# EAGLE design uc3906 charger 2 (EAGLE 9.6.2)
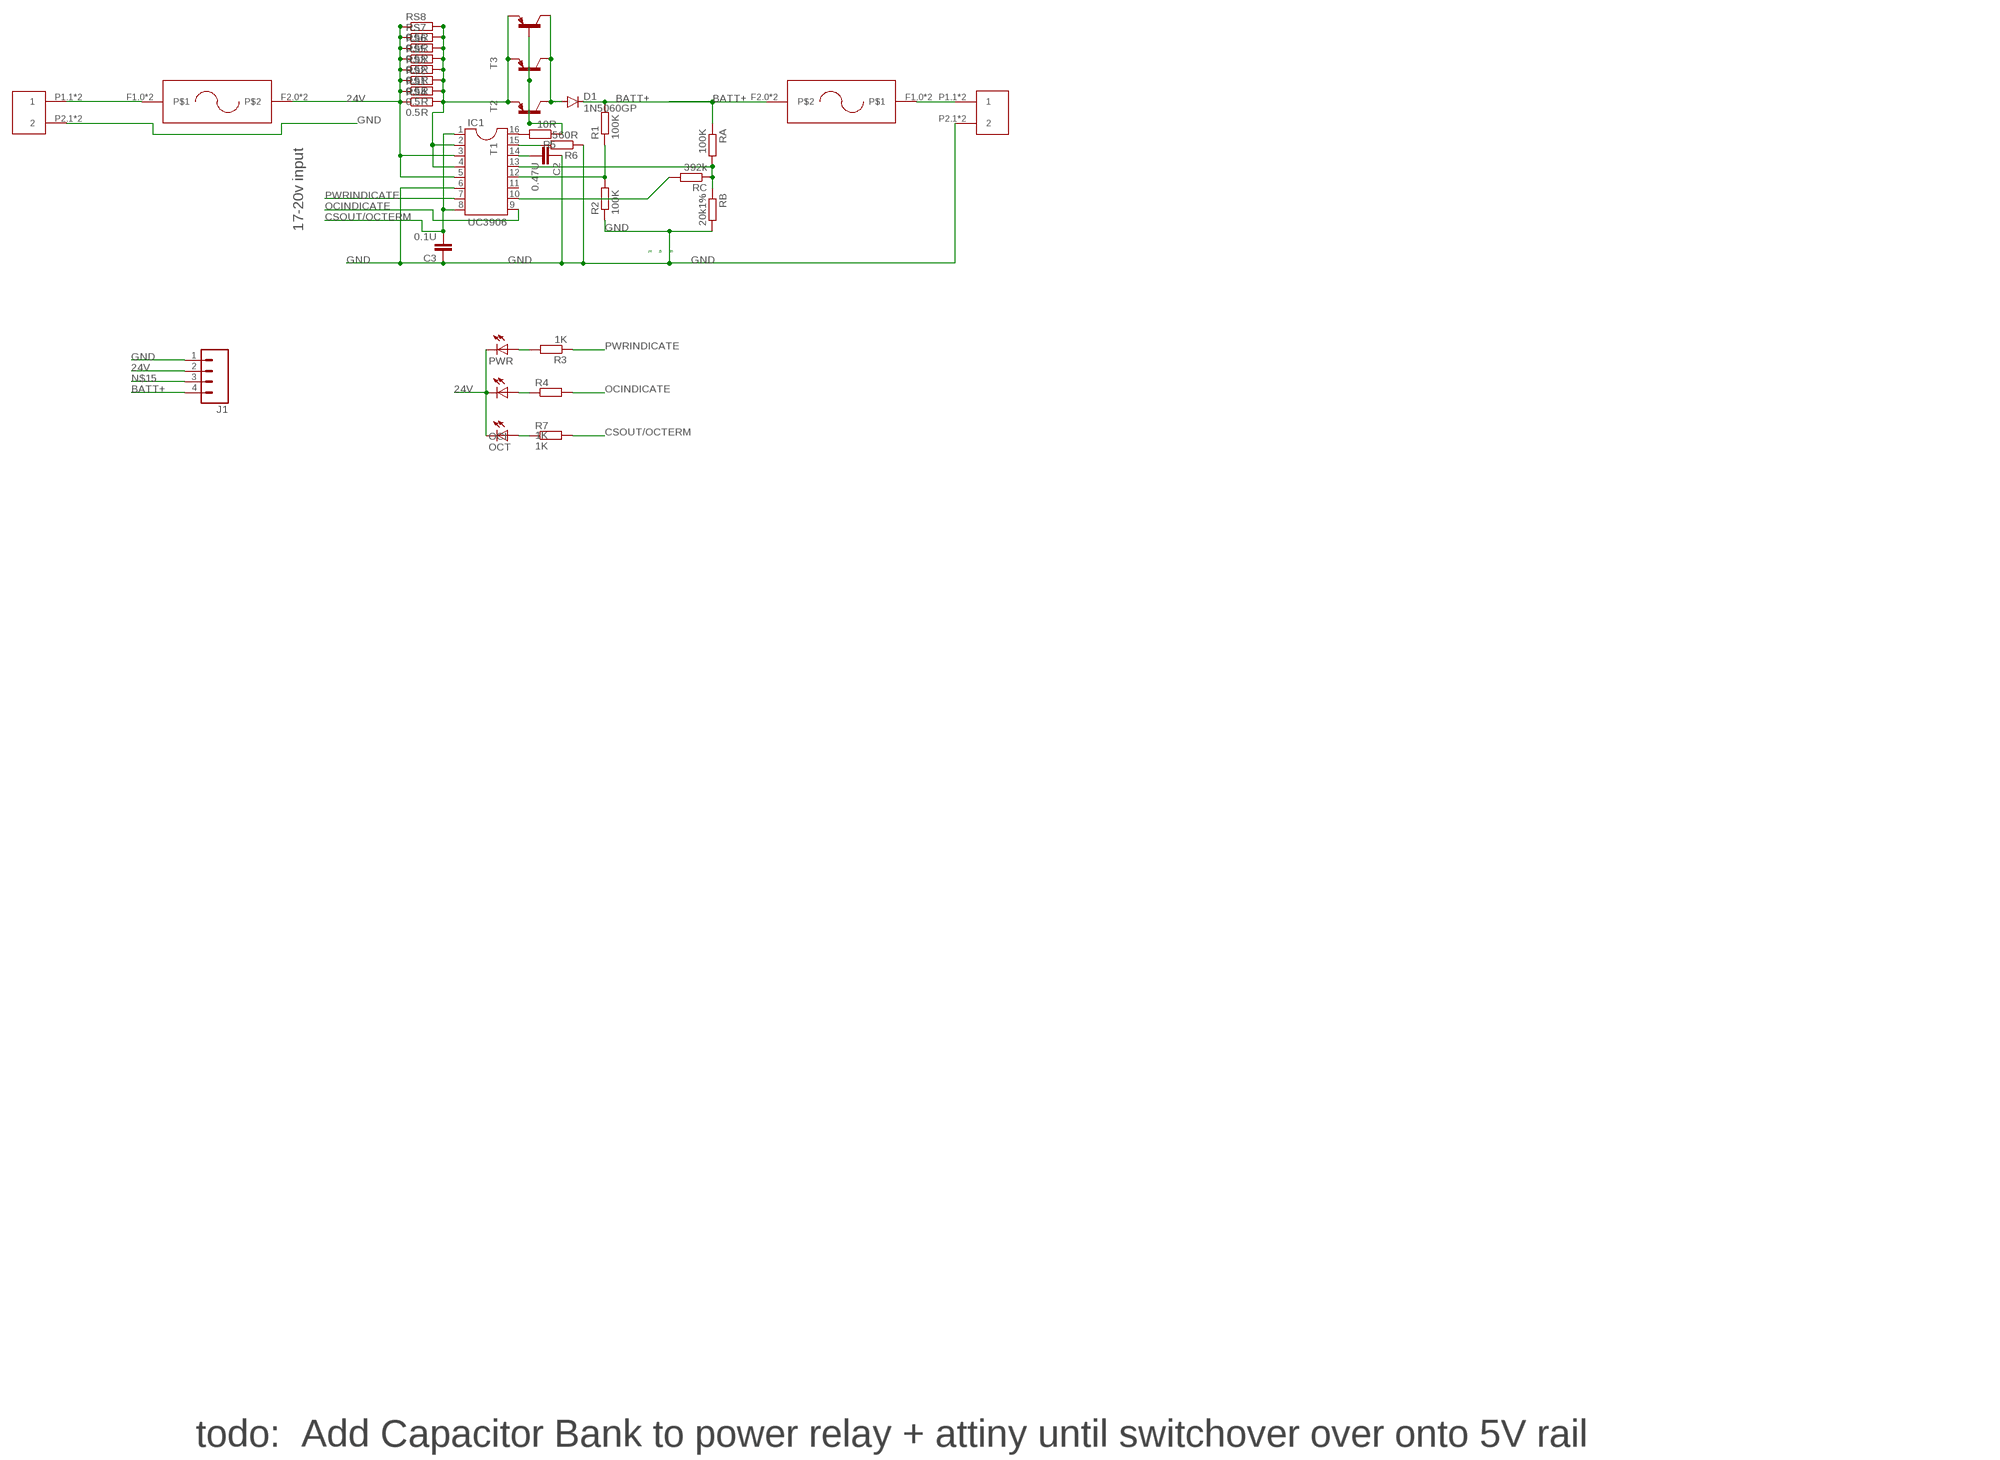
[diagram p0: schematic, sheet 1]

## Parts
BATT  BARRIERTERMINAL  [BARRIERTERMINAL]
C2  0.47U  C-EU050-024X044  [C050-024X044]
C3  0.1U  C-EU050-024X044  [C050-024X044]
D1  1N5060GP  [DO15-12]
IC1  UC3906  DIL16  [DIL16]
J1  CONN_04LONGPADS  [1X04_LONGPADS]
OCI  LED5MM  [LED5MM]
OCT  LED5MM  [LED5MM]
POWERIN  BARRIERTERMINAL  [BARRIERTERMINAL]
PWR  LED5MM  [LED5MM]
R1  100K  R-EU_0204/7  [0204/7]
R2  100K  R-EU_0204/7  [0204/7]
R3  1K  R-EU_0204/7  [0204/7]
R4  1K  R-EU_0204/7  [0204/7]
R5  10R  R-EU_0204/7  [0204/7]
R6  560R  R-EU_0204/7  [0204/7]
R7  1K  R-EU_0204/7  [0204/7]
RA  100K  R-EU_0204/7  [0204/7]
RB  20k1%  R-EU_0204/7  [0204/7]
RC  392k  R-EU_0204/7  [0204/7]
RS1  0.5R  R-EU_0411/15  [0411/15]
RS2  0.5R  R-EU_0411/15  [0411/15]
RS3  0.5R  R-EU_0411/15  [0411/15]
RS4  0.5R  R-EU_0411/15  [0411/15]
RS5  0.5R  R-EU_0411/15  [0411/15]
RS6  0.5R  R-EU_0411/15  [0411/15]
RS7  0.5R  R-EU_0411/15  [0411/15]
RS8  0.5R  R-EU_0411/15  [0411/15]
T1  TIP32C  [TO220]
T2  TIP32C  [TO220]
T3  TIP32C  [TO220]
U$1  18MMFUSEHOLDER  [18MMFUSEHOLDER]
U$2  18MMFUSEHOLDER  [18MMFUSEHOLDER]

## Nets
24V: IC1.3 IC1.5 J1.2 OCI.K(C) OCT.K(C) PWR.K(C) RS1.1 RS2.1 RS3.1 RS4.1 RS5.1 RS6.1 RS7.1 RS8.1 U$2.F2.0 U$2.F2.1
BATT+: D1.C J1.4 R1.2 RA.1 U$1.F2.0 U$1.F2.1
CHARGEENABLE: IC1.12 R1.1 R2.2
COMPENSATION: C2.2 IC1.14
CSOUT/OCTERM: C3.2 IC1.1 IC1.8 R7.2
DRIVERSINK: IC1.16 R5.2
DRIVERSOURCE: IC1.15 R6.2
GND: BATT.P2.1 BATT.P2.2 C2.1 C3.1 IC1.6 J1.1 POWERIN.P2.1 POWERIN.P2.2 R2.1 R6.1 RB.2
IOUT: IC1.2 IC1.4 RS1.2 RS2.2 RS3.2 RS4.2 RS5.2 RS6.2 RS7.2 RS8.2 T1.3(E) T2.3(E) T3.3(E)
N$1: POWERIN.P1.1 POWERIN.P1.2 U$2.F1.0 U$2.F1.1
N$2: PWR.A R3.2
N$5: OCI.A R4.1
N$6: OCT.A R7.1
N$9: BATT.P1.1 BATT.P1.2 U$1.F1.0 U$1.F1.1
N$14: R5.1 T1.1(B) T2.1(B) T3.1(B)
N$15: D1.A J1.3 T1.2(C) T2.2(C) T3.2(C)
OCINDICATE: IC1.9 R4.2
PWRINDICATE: IC1.7 R3.1
STATELEVELCONTROL: IC1.10 RC.2
VSENSE: IC1.13 RA.2 RB.1 RC.1
Unconnected: IC1.11

## Notes on the sheet
- 17-20v input
- J4 | J5 | J6
- todo:  Add Capacitor Bank to power relay + attiny until switchover over onto 5V rail

## Library data of the parts
BATT POWERIN = Barrier Terminals 2 pin:BARRIERTERMINAL
C2 C3 = rcl:C-EU: CAPACITOR, European symbol
D1 = diode:1N5060GP: DIODE controlled avalanche rectifier
IC1 = ic-package:DIL16: Dual In Line / Socket
J1 = SparkFun-Connectors2:CONN_04: Multi connection point. Often used as Generic Header-pin footprint for 0.1 inch spaced/style header connections On any of the 0.1 inch spaced packages, you can populate with these: Break Away Headers - Straight <https://www.sparkfun.com/products/116> (PRT-00116) Break Away Male Headers - Right Angle <https://www.sparkfun.com/products/553> (PRT-00553) Female Headers <https://www.sparkfun.com/products/115> (PRT-00115) Break Away Headers - Machine Pin <https://www.sparkfun.com/products/117> (PRT-00117) Break Away Female Headers - Swiss Machine Pin <https://www.sparkfun.com/products/743> (PRT-00743) For SCREWTERMINALS and SPRING TERMINALS visit here: Screw Terimnals on SparkFun.com <https://www.sparkfun.com/search/results?term=Screw+Terminals> (5mm/3.5mm/2.54mm spacing) This device is also useful as a general connection point to wire up your design to another part of your project. Our various solder wires solder well into these plated through hole pads. Hook-Up Wire - Assortment (Stranded, 22 AWG) <https://www.sparkfun.com/products/11375> (PRT-11375) Hook-Up Wire - Assortment (Solid Core, 22 AWG) <https://www.sparkfun.com/products/11367> (PRT-11367) View the entire wire category on our website here <https://www.sparkfun.com/categories/141> Special notes: Molex polarized connector foot print use with SKU : PRT-08231 with associated crimp pins and housings. 1MM SMD Version SKU: PRT-10208; PROD_ID: CONN-09696
OCI OCT PWR = RepRapjr:LED: LED OSRAM: - CHIPLED LG R971, LG N971, LY N971, LG Q971, LY Q971, LO R971, LY R971 LH N974, LH R974 LS Q976, LO Q976, LY Q976 LO Q996 - Hyper CHIPLED LW Q18S LB Q993, LB Q99A, LB R99A - SideLED LS A670, LO A670, LY A670, LG A670, LP A670 LB A673, LV A673, LT A673, LW A673 LH A674 LY A675 LS A676, LA A676, LO A676, LY A676, LW A676 LS A679, LY A679, LG A679 - Hyper Micro SIDELED® LS Y876, LA Y876, LO Y876, LY Y876 LT Y87S - SmartLED LW L88C, LW L88S LB L89C, LB L89S, LG L890 LS L89K, LO L89K, LY L89K LS L896, LA L896, LO L896, LY L896 - TOPLED LS T670, LO T670, LY T670, LG T670, LP T670 LSG T670, LSP T670, LSY T670, LOP T670, LYG T670 LG T671, LOG T671, LSG T671 LB T673, LV T673, LT T673, LW T673 LH T674 LS T676, LA T676, LO T676, LY T676, LB T676, LH T676, LSB T676, LW T676 LB T67C, LV T67C, LT T67C, LS T67K, LO T67K, LY T67K, LW E67C LS E67B, LA E67B, LO E67B, LY E67B, LB E67C, LV E67C, LT E67C LW T67C LS T679, LY T679, LG T679 LS T770, LO T770, LY T770, LG T770, LP T770 LB T773, LV T773, LT T773, LW T773 LH T774 LS E675, LA E675, LY E675, LS T675 LS T776, LA T776, LO T776, LY T776, LB T776 LHGB T686 LT T68C, LB T68C - Hyper Mini TOPLED® LB M676 - Mini TOPLED Santana® LG M470 LS M47K, LO M47K, LY M47K Source: http://www.osram.convergy.de LUXEON: - LUMILED® LXK2-PW12-R00, LXK2-PW12-S00, LXK2-PW14-U00, LXK2-PW14-V00 LXK2-PM12-R00, LXK2-PM12-S00, LXK2-PM14-U00 LXK2-PE12-Q00, LXK2-PE12-R00, LXK2-PE12-S00, LXK2-PE14-T00, LXK2-PE14-U00 LXK2-PB12-K00, LXK2-PB12-L00, LXK2-PB12-M00, LXK2-PB14-N00, LXK2-PB14-P00, LXK2-PB14-Q00 LXK2-PR12-L00, LXK2-PR12-M00, LXK2-PR14-Q00, LXK2-PR14-R00 LXK2-PD12-Q00, LXK2-PD12-R00, LXK2-PD12-S00 LXK2-PH12-R00, LXK2-PH12-S00 LXK2-PL12-P00, LXK2-PL12-Q00, LXK2-PL12-R00 Source: www.luxeon.com KINGBRIGHT: KA-3528ASYC Source: www.kingbright.com
R1-R7 RA RB RC = rcl:R-EU_: RESISTOR, European symbol
RS1-RS8 = resistor:R-EU_: RESISTOR, European symbol
T1-T3 = transistor:TIP32: PNP Transistor Medium Power Linear Switching Applications Source: http://onsemi.com
U$1 U$2 = Fuse Holder:18MMFUSEHOLDER

## Net classes
0 default: width 0.203 mm, clearance 0.152 mm
1 power: width 0.6 mm, clearance 0.305 mm

## Board
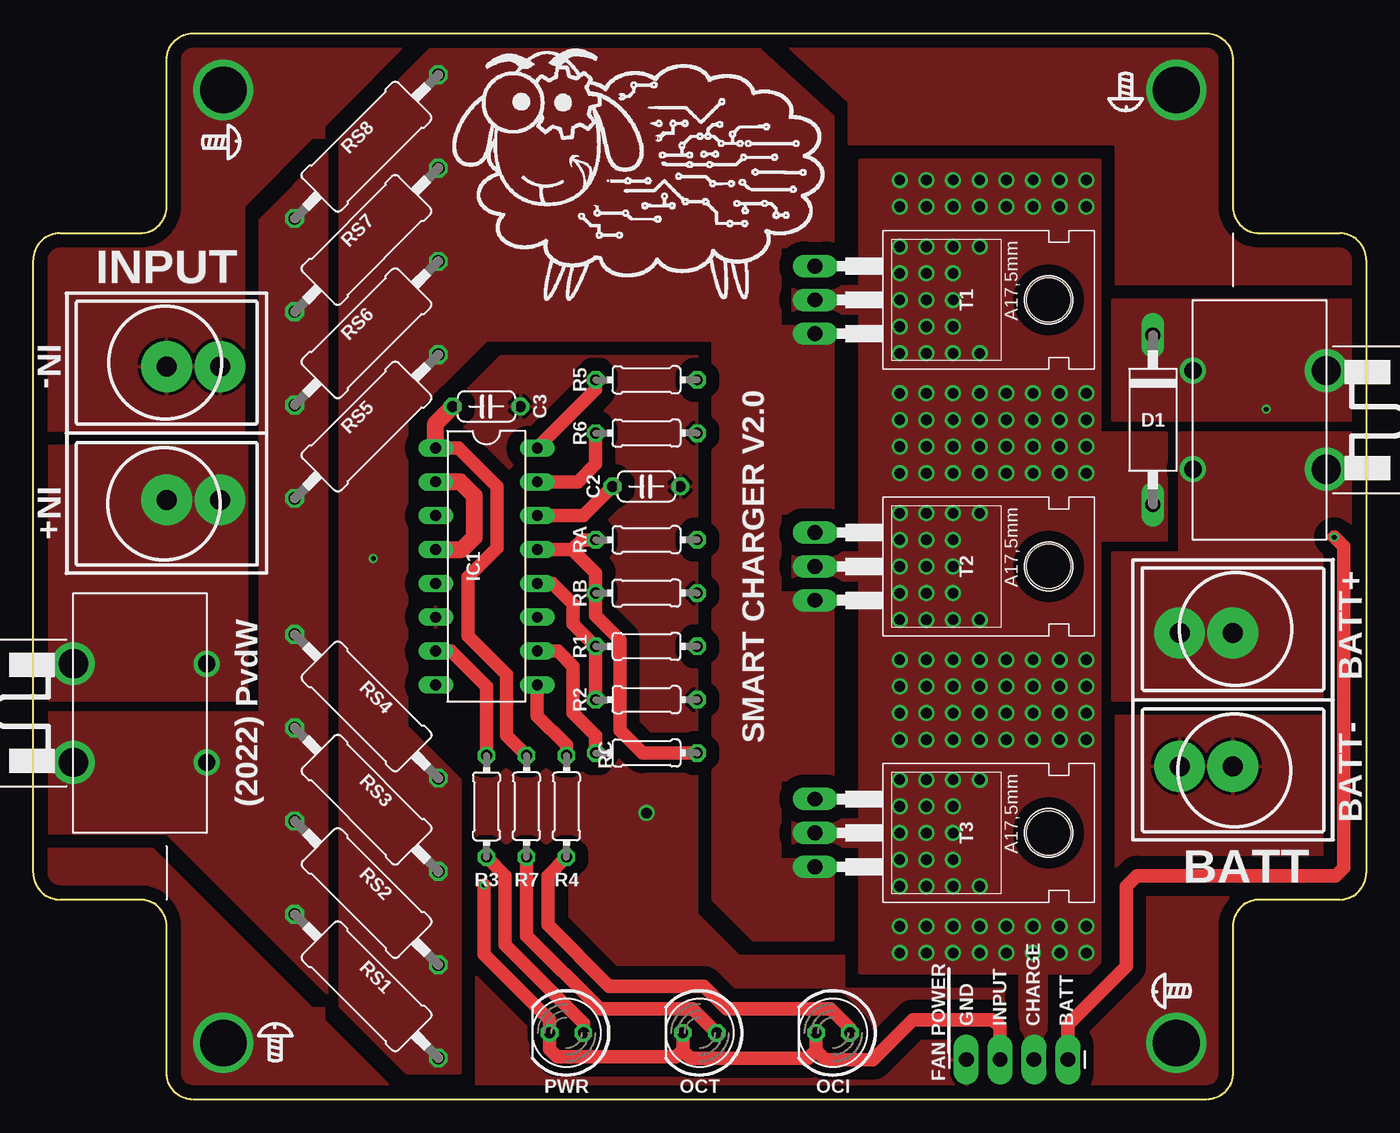
[diagram p1: board, top side]
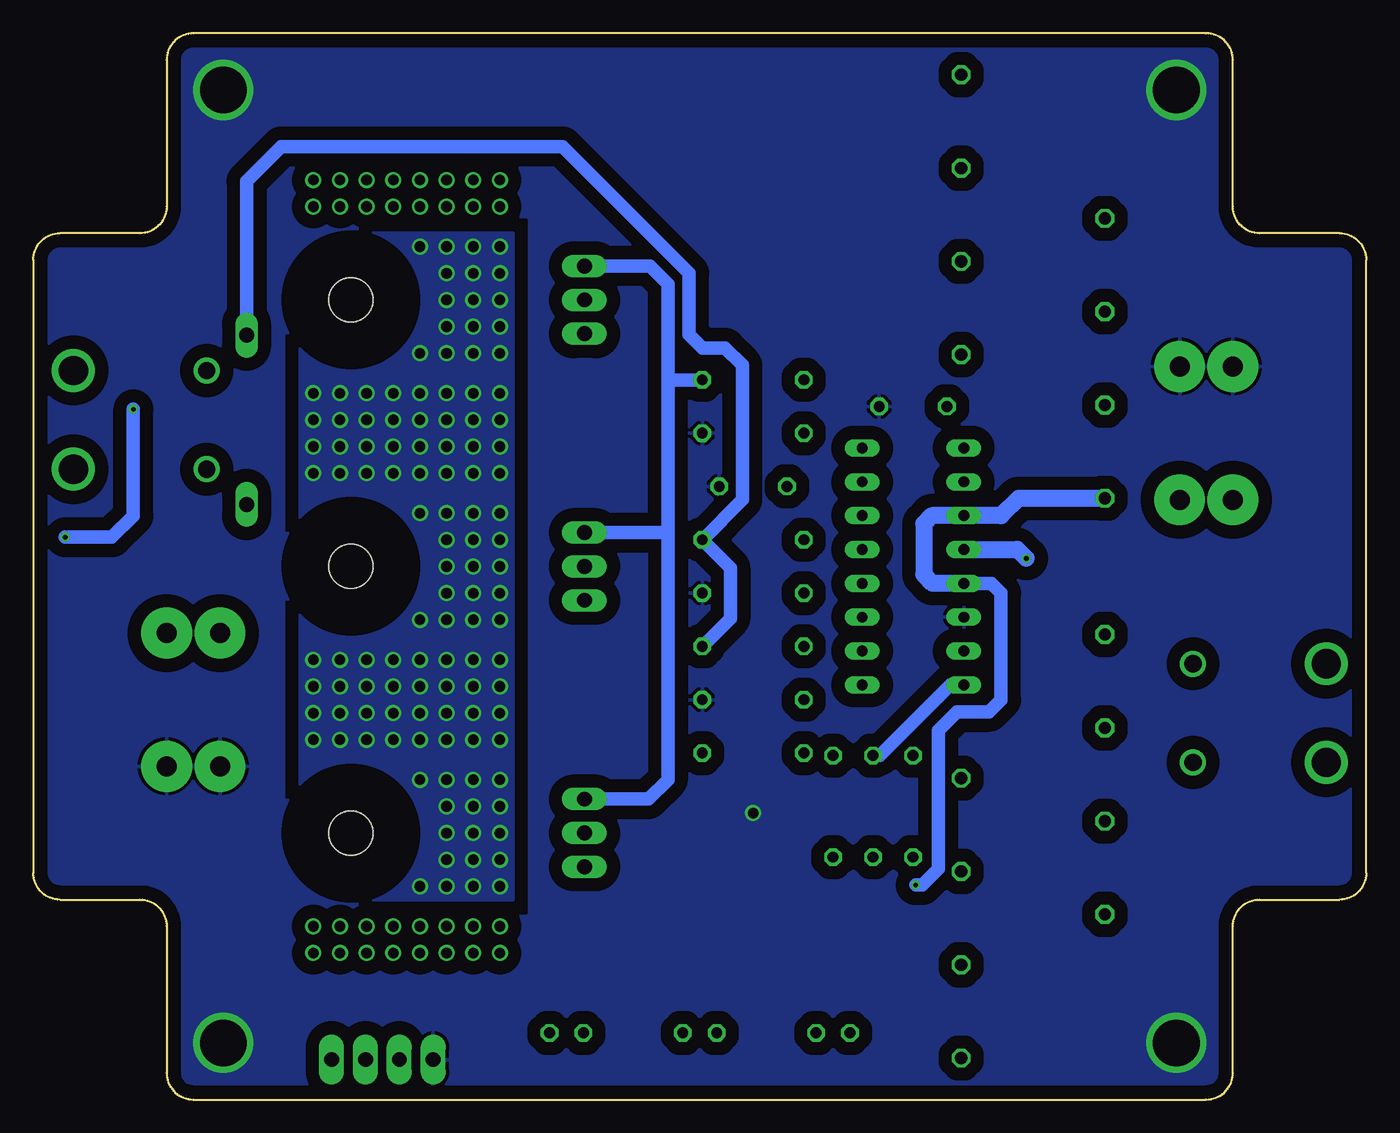
[diagram p2: board, bottom side, seen from below]

Size 100 x 80 mm. Coordinates in mm from the lower left corner, seen from the top.
Outline: 10,2 10,13 arc90 8,15 2,15 arc-90 0,17 0,63 arc-90 2,65 8,65 arc90 10,67 10,78 arc-90 12,80 88,80 arc-90 90,78 90,67 arc90 92,65 98,65 arc-90 100,63 100,17 arc-90 98,15 92,15 arc90 90,13 90,2 arc-90 88,0 12,0 arc-90 10,2
Copper layers (1*16): Top 0.035mm / dielectric 1.5mm / Bottom 0.035mm
Design rules "dirt_cheap_dirty_boards.v1": minimum track width 5mil, minimum drill 12mil, track to track 5mil, track to pad 5mil, pad to pad 5mil, via to via 5mil, smd to smd 0mil, copper to edge 10mil, drill to drill 10mil, minimum pad ring 10mil, minimum via ring 6mil, stop-mask expansion 2mil, vias tented up to drill 25mil, thermal gap 10mil

### Footprints (pad centres in the part's own frame; a part is rotated, then mirrored left to right if it is on the bottom)
BARRIERTERMINAL = drill 1.5 pad 3.81: P1.1 -5,0; P1.2 -5,-4; P2.1 5,0; P2.2 5,-4
C050-024X044 = drill 0.813 octagon: 1 -2.54,0; 2 2.54,0
DO15-12 = drill 1.118 long: A 6.35,0; C -6.35,0
DIL16 = drill 0.813 long: 1 -8.89,-3.81; 2 -6.35,-3.81; 3 -3.81,-3.81; 4 -1.27,-3.81; 5 1.27,-3.81; 6 3.81,-3.81; 7 6.35,-3.81; 8 8.89,-3.81; 9 8.89,3.81; 10 6.35,3.81; 11 3.81,3.81; 12 1.27,3.81; 13 -1.27,3.81; 14 -3.81,3.81; 15 -6.35,3.81; 16 -8.89,3.81
1X04_LONGPADS = drill 1.118 pad 1.88 long: 1 0,0; 2 2.54,0; 3 5.08,0; 4 7.62,0
LED5MM = drill 0.813 octagon: A -1.27,0; K 1.27,0
0204/7 = drill 0.813 octagon: 1 -3.81,0; 2 3.81,0
0411/15 = drill 0.914 octagon: 1 -7.62,0; 2 7.62,0
TO220 = drill 1.118 long: 1 -2.54,-6.35; 2 0,-6.35; 3 2.54,-6.35 | hole 3.302: 0,11.176
18MMFUSEHOLDER = drill 1.3: F1.0 -3.7,5; F2.0 3.7,5 | drill 2.2: F1.1 -3.7,-5; F2.1 3.7,-5

### Placement (x,y rotation side)
BATT  90,30 270 top
C2  46,46 180 top
C3  34,52 180 top
D1  84,51 270 top
IC1  34,40 270 top
J1  70,3 0 top
OCI  60,5 180 top
OCT  50,5 180 top
POWERIN  10,50 90 top
PWR  40,5 180 top
R1  46,34 0 top
R2  46,30 180 top
R3  34,22 270 top
R4  40,22 90 top
R5  46,54 180 top
R6  46,50 180 top
R7  37,22 90 top
RA  46,42 180 top
RB  46,38 0 top
RC  46,26 180 top
RS1  25,8.5 315 top
RS2  25,15.5 315 top
RS3  25,22.5 315 top
RS4  25,29.5 315 top
RS5  25,50.5 45 top
RS6  25,57.5 45 top
RS7  25,64.5 45 top
RS8  25,71.5 45 top
T1  65,60 270 top
T2  65,40 270 top
T3  65,20 270 top
U$1  92,51 90 top
U$2  8,29 270 top

### Tracks (layer width: path | path; a pad name or v marks a point on that pad's centre or on a via)
24V  (via drill 0.35)
  Top 1.016: OCI.K 58.73,3.7 | 58.73,3.7 58.13,3.1 49.3,3.1 48.73,3.67 OCT.K 48.73,3.73 48.2,3.2 39.3,3.2 38.73,3.77 PWR.K 38.73,5.97 33.8,10.9 v33.8,16.1 | J1.2 72.5,3.04 72.5,5.5 72,6 66,6 63,3 59.43,3 58.73,3.7
  Bottom 1.016: v33.8,16.1 33.3,16.1 32.1,17.3 32.1,27.7 30.7,29.1 28.3,29.1 27.4,30 27.4,38 28.13,38.73 IC1.5
  Bottom 1.27: RS5.1 26.09,45.11 27.39,43.81 IC1.3 32.59,43.81 33.2,43.2 33.2,39.4 32.53,38.73 IC1.5
  pour Top (isolate 1, no thermals): 1,29 17,29 17,66 22,71 22,8 10,20 1,20
BATT+  (via drill 0.35)
  Top 1.016: J1.4 77.62,5.62 82,10 82,16 82.8,16.8 97.7,16.8 98.3,17.4 98.3,41.5 v97.6,42.2
  Bottom 1.016: R1.2 47.7,36.11 47.7,39.89 RA.1 46.8,45.01 46.8,55.1 48.1,56.4 49.8,56.4 50.8,57.4 50.8,62 60.3,71.5 81.4,71.5 84,68.9 D1.C | v97.6,42.2 94.1,42.2 92.5,43.8 v92.5,51.8
  pour Top (isolate 1, no thermals): 81,51 99,51 99,60 81,60
CHARGEENABLE
  Top 1.016: R2.2 R1.1 40.5,35.69 40.5,37.2 38.97,38.73 IC1.12
COMPENSATION
  Top 1.016: IC1.14 41.27,43.81 C2.2
CSOUT/OCTERM
  Top 1.016: R7.2 35.5,27.31 35.5,31.9 32.6,34.8 32.6,39.2 34.8,41.4 34.8,46 31.91,48.89 IC1.1
  Top 1.27: IC1.1 30.19,50.73 C3.2
  Bottom 1.016: IC1.8 31.19,31.11 36.49,25.81 R7.2
DRIVERSINK
  Top 1.016: IC1.16 42.19,53.27 R5.2
DRIVERSOURCE
  Top 1.016: IC1.15 40.85,46.35 42.19,47.69 R6.2
GND  (via drill 0.8, 3.5)
  other vias: 14.25,4.25 85.75,4.25 85.75,75.75 14.25,75.75 46,21.5
  pour Top (isolate 1, rank 6): 0,63 2,65 8,65 10,67 10,78 12,80 88,80 90,78 90,67 92,65 98,65 100,63 100,17 98,15 92,15 90,13 90,2 88,0 12,0 10,2 10,13 8,15 2,15 0,17
  pour Bottom (isolate 1, rank 6): 0,63 2,65 8,65 10,67 10,78 12,80 88,80 90,78 90,67 92,65 98,65 100,63 100,17 98,15 92,15 90,13 90,2 88,0 12,0 10,2 10,13 8,15 2,15 0,17
IOUT  (via drill 0.35)
  Top 1.27: IC1.4 32.17,41.27 33.1,42.2 33.1,45.3 32.05,46.35 IC1.2
  Bottom 1.27: IC1.4 26.17,41.27 v25.5,40.6
  pour Top (isolate 1, no thermals): 60,58 56,58 56,64 60,64 60,73.77 54.25,79 30,79 23,72 23,7 28,2 32,2 32,24 28,28 28,51 34,57 51,57 51,15 54,12 60,12 60,18 56,18 56,24 60,24 60,38 56,38 56,44 60,44
N$1
  pour Top (isolate 1, no thermals): 1,30 16,30 16,49 1,49
N$2
  Top 1.016: R3.2 35.4,16.79 35.4,11.59 41.27,5.72 PWR.A
N$5
  Top 1.016: R4.1 38.6,16.79 38.6,13.1 43.2,8.5 50.3,8.5 52,6.8 59.8,6.8 61.27,5.33 OCI.A
N$6
  Top 1.016: R7.1 37,12.3 42.5,6.8 49.47,6.8 OCT.A
N$9
  pour Top (isolate 1, no thermals): 82,41 86,41 86,50 99,50 99,30 81,30 81,41
N$14
  Bottom 1.016: T3.1 53.86,22.54 52.4,24 52.4,42.6 | T2.1 52.46,42.54 52.4,42.6 | T1.1 53.74,62.54 52.4,61.2 52.4,54 | 52.4,42.6 52.4,54 | R5.1 52.4,54
N$15  (via drill 0.8)
  other vias: 65,64 67,64 69,64 71,64 65,62 67,62 69,62 69,60 67,60 65,60 65,58 67,58 69,58 71,56 69,56 67,56 65,56 65,44 67,44 69,44 71,44 71,36 69,36 67,36 65,36 65,38 65,40 65,42 67,42 67,40 67,38 69,38 69,40 69,42 65,24 67,24 69,24 71,24 71,16 69,16 67,16 65,16 65,18 65,20 65,22 67,22 67,20 67,18 69,18 69,20 69,22 67,27 67,29 67,31 67,33 69,33 69,31 69,29 69,27 71,27 71,29 71,31 71,33 65,33 65,31 65,29 65,27 73,27 73,29 73,31 73,33 75,33 75,31 75,29 75,27 77,27 77,29 77,31 77,33 79,33 79,31 79,29 79,27 65,47 65,49 65,51 65,53 67,53 67,51 67,49 67,47 69,47 69,49 69,51 69,53 71,53 71,51 71,49 71,47 73,47 73,49 73,51 73,53 75,53 75,51 75,49 75,47 77,47 79,47 79,49 79,51 79,53 77,53 77,51 77,49 65,67 65,69 67,69 67,67 69,67 69,69 71,69 71,67 73,67 73,69 75,69 75,67 77,67 77,69 79,69 79,67 65,13 65,11 67,11 67,13 69,13 69,11 71,13 71,11 73,13 73,11 75,13 75,11 77,13 77,11 79,13 79,11
  pour Top (isolate 1, no thermals): 57,61 62,61 62,70.5 80,70.5 80,50 85,50 85,42 80,42 80,9.5 76,9.5 76,3 74,3 74,9.5 62,9.5 62,19 57,19 57,21 62,21 62,39 57,39 57,41 62,41 62,59 57,59
  pour Bottom (isolate 1, no thermals): 64,65 64,15 80,15 80,65
OCINDICATE
  Top 1.016: IC1.9 37.81,28.79 40,26.6 R4.2
PWRINDICATE
  Top 1.016: R3.1 34,31 31.35,33.65 IC1.7
STATELEVELCONTROL
  Top 1.016: IC1.10 39.35,33.65 40.5,32.5 40.5,29 42.19,27.31 RC.2
VSENSE
  Top 1.016: RC.1 45.7,26 44,27.7 44,34.5 42.19,36.31 RB.1 42.19,39.51 40.43,41.27 | 40.43,41.27 IC1.13 | RA.2 41.16,42 40.43,41.27

### Text on the board
tPlace: INPUT | IN- | IN+ | SMART CHARGER V2.0 | BATT+ | (2022) PvdW | BATT- | BATT | FAN POWER | GND | INPUT | CHARGE | BATT